# Altium schematic sheet RS232.SchDoc
size A; SheetNumber: 2; SheetTotal: 9
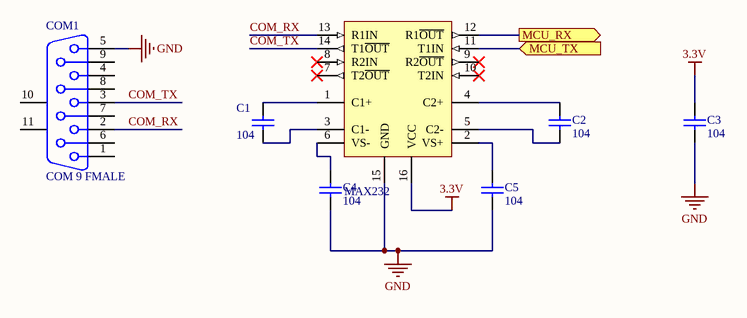
[diagram p0: RS232.SchDoc]

## Parts
C1  104  [tu 0805]
C2  104  [tu 0805]
C3  104  [tu 0805]
C4  104  [tu 0805]
C5  104  [tu 0805]
COM1  COM 9 FMALE  [DSB 9-F]
IC1  MAX232  [DIP16/W0.3]

## Ports
MCU_RX (out), MCU_TX (in)

## Nets
3.3V: C3.1 IC1.16(VCC)
GND: C3.2 C4.2 C5.2 COM1.5 IC1.15(GND)
COM_RX: COM1.2 IC1.13(R1IN)
COM_TX: COM1.3 IC1.14(T1~{OUT})
MCU_RX: IC1.12(R1~{OUT}) ; port MCU_RX
MCU_TX: IC1.11(T1IN) ; port MCU_TX
NetC1_1: C1.1 IC1.1(C1+)
NetC1_2: C1.2 IC1.3(C1-)
NetC2_1: C2.1 IC1.4(C2+)
NetC2_2: C2.2 IC1.5(C2-)
NetC4_1: C4.1 IC1.6(VS-)
NetC5_1: C5.1 IC1.2(VS+)

Not connected (* = marked no-connect by the designer): COM1 1 4 6 7 8 9 10(MH1) 11(MH2); IC1 7(T2~{OUT})* 8(R2IN)* 9(R2~{OUT})* 10(T2IN)*

## Library data of the parts
C1-C5 = Tu 0805 104 50V 10%: Dán; Don_Vi: Con; So_Chan: 2; Ten_Linh_Kien: Tụ 0805 104-100nF 10% 50V; Ma_Hang: MH004551; Chung_Loai: Dán; Kieu_Chan: *
COM1 = DSB9F: COM 9; PackageDocument: O; Positions: 9; Gender: Receptacle; Value: COM 9; Published: 15-Jun-2001; LatestRevisionDate: 17-Jul-2002; LatestRevisionNote: Re-released for DXP Platform.; DatasheetDocument: 1-Sep-1999; PackageReference: 788750; Publisher: Altium Limited; Orientation: Right Angle
IC1 = MAX232: Dual EIA-232 Driver/Receiver; Value: MAX232